# Altium schematic sheet NRF52.SchDoc
size A4
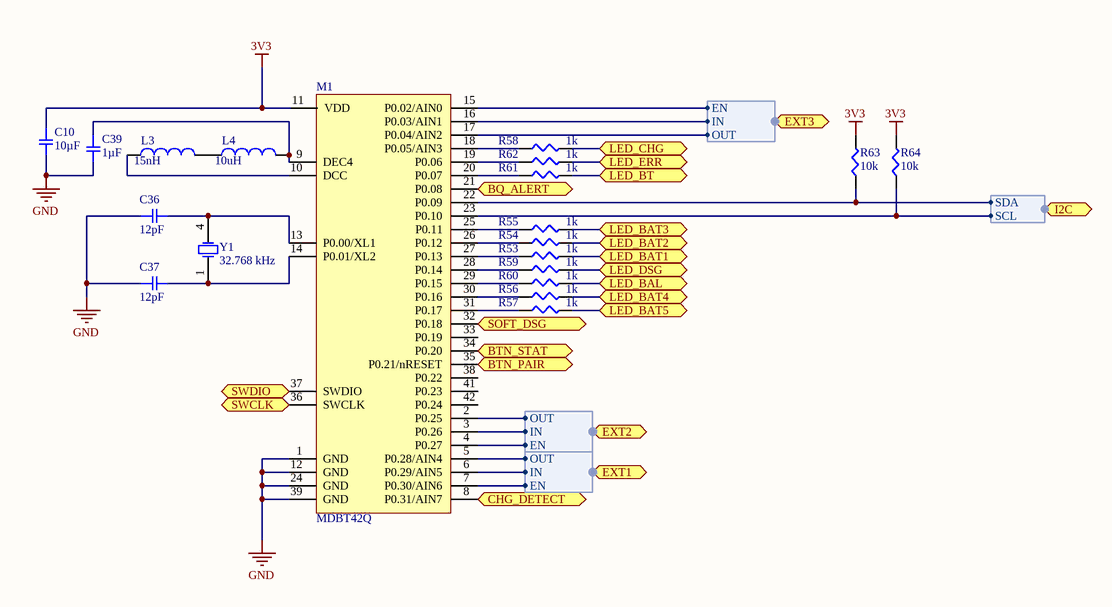
[diagram p0: NRF52.SchDoc]

## Parts
C10  10µF  [SMD-0603C]
C36  12pF  [SMD-0603C]
C37  12pF  [SMD-0603C]
C39  1µF  [SMD-0603C]
L3  value 15nH  [0402-A]  (hidden comment: Inductor)
L4  value 10uH  [0402-A]  (hidden comment: Inductor)
M1  MDBT42Q  [MDBT42Q]
R53  1k  [SMD-0603-RES]
R54  1k  [SMD-0603-RES]
R55  1k  [SMD-0603-RES]
R56  1k  [SMD-0603-RES]
R57  1k  [SMD-0603-RES]
R58  1k  [SMD-0603-RES]
R59  1k  [SMD-0603-RES]
R60  1k  [SMD-0603-RES]
R61  1k  [SMD-0603-RES]
R62  1k  [SMD-0603-RES]
R63  10k  [SMD-0603-RES]
R64  10k  [SMD-0603-RES]
Y1  32.768 kHz  [LFXTAL]

## Ports
BQ_ALERT, BTN_PAIR, BTN_STAT, CHG_DETECT, EXT1 (harness EXT), EXT2 (harness EXT), EXT3 (harness EXT), I2C (harness I2C), LED_BAL, LED_BAT1, LED_BAT2, LED_BAT3, LED_BAT4, LED_BAT5, LED_BT, LED_CHG, LED_DSG, LED_ERR, SOFT_DSG, SWCLK, SWDIO

## Harnesses
EXT: IN, OUT, EN
I2C: SCL, SDA

## Nets
3V3: C10.1 M1.11(VDD) R63.2 R64.2
GND: C10.2 C36.1 C37.1 C39.2 M1.1(GND) M1.12(GND) M1.24(GND) M1.39(GND)
BQ_ALERT: M1.21(P0.08) ; port BQ_ALERT
BTN_PAIR: M1.35(P0.21/nRESET) ; port BTN_PAIR
BTN_STAT: M1.34(P0.20) ; port BTN_STAT
CHG_DETECT: M1.8(P0.31/AIN7) ; port CHG_DETECT
LED_BAL: R60.2 ; port LED_BAL
LED_BAT1: R53.2 ; port LED_BAT1
LED_BAT2: R54.2 ; port LED_BAT2
LED_BAT3: R55.2 ; port LED_BAT3
LED_BAT4: R56.2 ; port LED_BAT4
LED_BAT5: R57.2 ; port LED_BAT5
LED_BT: R61.2 ; port LED_BT
LED_CHG: R58.2 ; port LED_CHG
LED_DSG: R59.2 ; port LED_DSG
LED_ERR: R62.2 ; port LED_ERR
SOFT_DSG: M1.32(P0.18) ; port SOFT_DSG
SWCLK: M1.36(SWCLK) ; port SWCLK
SWDIO: M1.37(SWDIO) ; port SWDIO
NetC36_2: C36.2 M1.13(P0.00/XL1) Y1.4(OSC2)
NetC37_2: C37.2 M1.14(P0.01/XL2) Y1.1(OSC1)
NetC39_1: C39.1 L4.2 M1.9(DEC4)
NetL3_1: L3.1 M1.10(DCC)
NetL3_2: L3.2 L4.1
NetM1_2: M1.2(P0.25) ; port EXT2.OUT
NetM1_3: M1.3(P0.26) ; port EXT2.IN
NetM1_4: M1.4(P0.27) ; port EXT2.EN
NetM1_5: M1.5(P0.28/AIN4) ; port EXT1.OUT
NetM1_6: M1.6(P0.29/AIN5) ; port EXT1.IN
NetM1_7: M1.7(P0.30/AIN6) ; port EXT1.EN
NetM1_15: M1.15(P0.02/AIN0) ; port EXT3.EN
NetM1_16: M1.16(P0.03/AIN1) ; port EXT3.IN
NetM1_17: M1.17(P0.04/AIN2) ; port EXT3.OUT
NetM1_18: M1.18(P0.05/AIN3) R58.1
NetM1_19: M1.19(P0.06) R62.1
NetM1_20: M1.20(P0.07) R61.1
NetM1_22: M1.22(P0.09) R63.1 ; port I2C.SDA
NetM1_23: M1.23(P0.10) R64.1 ; port I2C.SCL
NetM1_25: M1.25(P0.11) R55.1
NetM1_26: M1.26(P0.12) R54.1
NetM1_27: M1.27(P0.13) R53.1
NetM1_28: M1.28(P0.14) R59.1
NetM1_29: M1.29(P0.15) R60.1
NetM1_30: M1.30(P0.16) R56.1
NetM1_31: M1.31(P0.17) R57.1

Not connected (* = marked no-connect by the designer): M1 33(P0.19) 38(P0.22) 41(P0.23) 42(P0.24)

## Library data of the parts
C10 = GRM185R60J106ME15D: CAP CER 10UF 6.3V X5R 0603; Manufacturer: Murata Electronics North America; Factory Stock: 0; Unit Price (USD): 0.36; Minimum Quantity: 1; Tolerance: ±20%; Datasheets: http://www.murata.com/~/media/webrenewal/support/library/catalog/products/capacitor/mlcc/c02e.pdf; Image: //media.digikey.com/Renders/Murata%20Renders/ZRB-SERIES-0402.jpg; Digi-Key Part Number: 490-10467-1-ND; Part Number: GRM185R60J106ME15D; Quantity Available: 25068; @ qty: 0; Packaging: Cut Tape (CT); Series: GRM; Part Status: Active; Value: 10µF; Voltage: 6.3V; Temperature Coefficient: X5R; Operating Temperature: -55°C ~ 85°C; Features: Derating Recommended; Ratings: -; Applications: General Purpose; Mounting Type: Surface Mount, MLCC; Package / Case: 0603 (1608 Metric); Size / Dimension: 0.063" L x 0.031" W (1.60mm x 0.80mm); Height - Seated (Max): -; Thickness (Max): 0.022" (0.55mm); Lead Spacing: -; Lead Style: -
C36 C37 = GCM1885C1H120JA16D: CAP CER 12PF 50V NP0 0603; Manufacturer: Murata Electronics North America; Factory Stock: 0; Unit Price (USD): 0.1; Minimum Quantity: 1; Tolerance: ±5%; Temperature Coefficient: C0G, NP0; Datasheets: http://www.murata.com/~/media/webrenewal/support/library/catalog/products/capacitor/mlcc/c03e.ashx; Image: //media.digikey.com/Renders/Murata%20Renders/0603%28GCM188%29.jpg; Digi-Key Part Number: 490-6045-1-ND; Part Number: GCM1885C1H120JA16D; Quantity Available: 35071; @ qty: 0; Packaging: Cut Tape (CT); Series: GCM; Part Status: Active; Value: 12pF; Voltage: 50V; Operating Temperature: -55°C ~ 125°C; Features: -; Ratings: AEC-Q200; Applications: Automotive; Mounting Type: Surface Mount, MLCC; Package / Case: 0603 (1608 Metric); Size / Dimension: 0.063" L x 0.031" W (1.60mm x 0.80mm); Height - Seated (Max): -; Thickness (Max): 0.035" (0.90mm); Lead Spacing: -; Lead Style: -
C39 = GCM188R71C105KA64D: CAP CER 1UF 16V X7R 0603; Manufacturer: Murata Electronics North America; Factory Stock: 0; Unit Price (USD): 0.24; Minimum Quantity: 1; Tolerance: ±10%; Datasheets: http://www.murata.com/~/media/webrenewal/support/library/catalog/products/capacitor/mlcc/c03e.ashx; Image: //media.digikey.com/Renders/Murata%20Renders/0603%28GCM188%29.jpg; Digi-Key Part Number: 490-5241-1-ND; Part Number: GCM188R71C105KA64D; Quantity Available: 9243; @ qty: 0; Packaging: Cut Tape (CT); Series: GCM; Part Status: Active; Value: 1µF; Voltage: 16V; Temperature Coefficient: X7R; Operating Temperature: -55°C ~ 125°C; Features: -; Ratings: AEC-Q200; Applications: Automotive; Mounting Type: Surface Mount, MLCC; Package / Case: 0603 (1608 Metric); Size / Dimension: 0.063" L x 0.031" W (1.60mm x 0.80mm); Height - Seated (Max): -; Thickness (Max): 0.035" (0.90mm); Lead Spacing: -; Lead Style: -
L3 L4 = Inductor: Code_IEC: 1005; Published: 8-Jun-2000; LatestRevisionDate: 29-May-2009; LatestRevisionNote: IPC-7351 Footprint Added.; PackageReference: 0402-A; Publisher: Altium Limited; PackageDescription: Chip Inductor; Code_JEITA: 0402
M1 = MDBT42Q: nRF52832 module
R53-R62 = ERJ-3EKF1001V: RES SMD 1K OHM 1% 1/10W 0603; Manufacturer: Panasonic Electronic Components; Factory Stock: 0; Unit Price (USD): 0.00379; @ qty: 1500; Minimum Quantity: 1; Power (Watts): 0.1W, 1/10W; Temperature Coefficient: ±100ppm/°C; Part Number: ERJ-3EKF1001V; Datasheets: http://industrial.panasonic.com/www-cgi/jvcr13pz.cgi?E+PZ+3+AOA0002+ERJ3EKF1001V+7+WW; Image: //media.digikey.com/Photos/Panasonic%20Photos/MFG_ERJ-P6W%20Series.jpg; Digi-Key Part Number: P1.00KHCT-ND; Quantity Available: 5218845; Packaging: Cut Tape (CT); Series: ERJ; Part Status: Active; Value: 1k; Tolerance: ±1%; Composition: Thick Film; Features: Automotive AEC-Q200; Operating Temperature: -55°C ~ 155°C; Package / Case: 0603 (1608 Metric); Supplier Device Package: 0603; Size / Dimension: 0.063" L x 0.031" W (1.60mm x 0.80mm); Height - Seated (Max): 0.022" (0.55mm); Number of Terminations: 2; Failure Rate: -
R63 R64 = ERJ-3EKF1002V: RES SMD 10K OHM 1% 1/10W 0603; Manufacturer: Panasonic Electronic Components; Factory Stock: 0; Unit Price (USD): 0.00379; @ qty: 1500; Minimum Quantity: 1; Power (Watts): 0.1W, 1/10W; Temperature Coefficient: ±100ppm/°C; Part Number: ERJ-3EKF1002V; Datasheets: http://industrial.panasonic.com/www-cgi/jvcr13pz.cgi?E+PZ+3+AOA0002+ERJ3EKF1002V+7+WW; Image: //media.digikey.com/Photos/Panasonic%20Photos/MFG_ERJ-P6W%20Series.jpg; Digi-Key Part Number: P10.0KHCT-ND; Quantity Available: 6703141; Packaging: Cut Tape (CT); Series: ERJ; Part Status: Active; Value: 10k; Tolerance: ±1%; Composition: Thick Film; Features: Automotive AEC-Q200; Operating Temperature: -55°C ~ 155°C; Package / Case: 0603 (1608 Metric); Supplier Device Package: 0603; Size / Dimension: 0.063" L x 0.031" W (1.60mm x 0.80mm); Height - Seated (Max): 0.022" (0.55mm); Number of Terminations: 2; Failure Rate: -
Y1 = LFXTAL016178: Published: 8-Jun-2000; LatestRevisionDate: 17-Jul-2002; LatestRevisionNote: Re-released for DXP Platform.; PackageReference: R38; Publisher: Altium Limited; PackageDescription: Crystal, Thru-Hole; 2 Leads; Body 3.1 x 8.2 mm (Dia.xH)